# EAGLE design Test PCB (EAGLE 6.5.0)
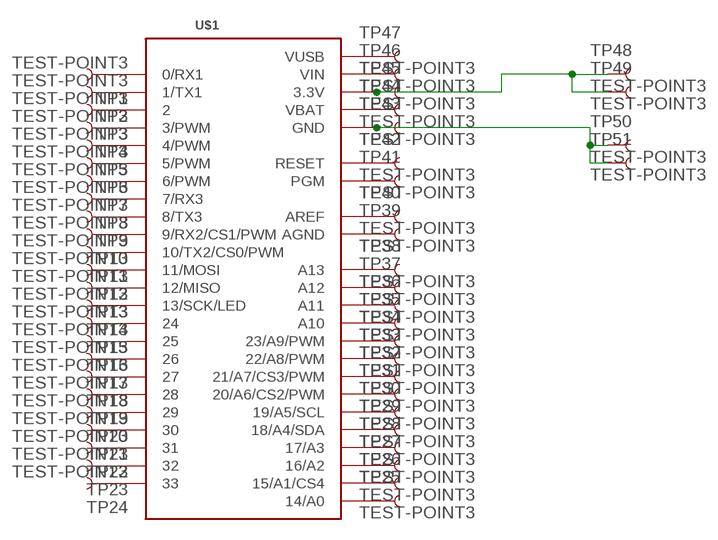
[diagram p0: schematic, sheet 1]

## Parts
TP1  TEST-POINT3  [PAD.03X.03]
TP2  TEST-POINT3  [PAD.03X.03]
TP3  TEST-POINT3  [PAD.03X.03]
TP4  TEST-POINT3  [PAD.03X.03]
TP5  TEST-POINT3  [PAD.03X.03]
TP6  TEST-POINT3  [PAD.03X.03]
TP7  TEST-POINT3  [PAD.03X.03]
TP8  TEST-POINT3  [PAD.03X.03]
TP9  TEST-POINT3  [PAD.03X.03]
TP10  TEST-POINT3  [PAD.03X.03]
TP11  TEST-POINT3  [PAD.03X.03]
TP12  TEST-POINT3  [PAD.03X.03]
TP13  TEST-POINT3  [PAD.03X.03]
TP14  TEST-POINT3  [PAD.03X.03]
TP15  TEST-POINT3  [PAD.03X.03]
TP16  TEST-POINT3  [PAD.03X.03]
TP17  TEST-POINT3  [PAD.03X.03]
TP18  TEST-POINT3  [PAD.03X.03]
TP19  TEST-POINT3  [PAD.03X.03]
TP20  TEST-POINT3  [PAD.03X.03]
TP21  TEST-POINT3  [PAD.03X.03]
TP22  TEST-POINT3  [PAD.03X.03]
TP23  TEST-POINT3  [PAD.03X.03]
TP24  TEST-POINT3  [PAD.03X.03]
TP25  TEST-POINT3  [PAD.03X.03]
TP26  TEST-POINT3  [PAD.03X.03]
TP27  TEST-POINT3  [PAD.03X.03]
TP28  TEST-POINT3  [PAD.03X.03]
TP29  TEST-POINT3  [PAD.03X.03]
TP30  TEST-POINT3  [PAD.03X.03]
TP31  TEST-POINT3  [PAD.03X.03]
TP32  TEST-POINT3  [PAD.03X.03]
TP33  TEST-POINT3  [PAD.03X.03]
TP34  TEST-POINT3  [PAD.03X.03]
TP35  TEST-POINT3  [PAD.03X.03]
TP36  TEST-POINT3  [PAD.03X.03]
TP37  TEST-POINT3  [PAD.03X.03]
TP38  TEST-POINT3  [PAD.03X.03]
TP39  TEST-POINT3  [PAD.03X.03]
TP40  TEST-POINT3  [PAD.03X.03]
TP41  TEST-POINT3  [PAD.03X.03]
TP42  TEST-POINT3  [PAD.03X.03]
TP43  TEST-POINT3  [PAD.03X.03]
TP44  TEST-POINT3  [PAD.03X.03]
TP45  TEST-POINT3  [PAD.03X.03]
TP46  TEST-POINT3  [PAD.03X.03]
TP47  TEST-POINT3  [PAD.03X.03]
TP48  TEST-POINT3  [PAD.03X.03]
TP49  TEST-POINT3  [PAD.03X.03]
TP50  TEST-POINT3  [PAD.03X.03]
TP51  TEST-POINT3  [PAD.03X.03]
U$1  TEENSY_3.0_ALLPINSTEENSY_3.0_ALLPINS-SMD  [TEENSY_3.0_ALLPINS-SMD]

## Nets
N$1: TP1.P$1 U$1.0(0/RX1)
N$2: TP2.P$1 U$1.1(1/TX1)
N$3: TP3.P$1 U$1.2
N$4: TP4.P$1 U$1.3(3/PWM)
N$5: TP5.P$1 U$1.4(4/PWM)
N$6: TP6.P$1 U$1.5(5/PWM)
N$7: TP7.P$1 U$1.6(6/PWM)
N$8: TP8.P$1 U$1.7(7/RX3)
N$9: TP9.P$1 U$1.8(8/TX3)
N$10: TP10.P$1 U$1.9(9/RX2/CS1/PWM)
N$11: TP11.P$1 U$1.10(10/TX2/CS0/PWM)
N$12: TP12.P$1 U$1.11(11/MOSI)
N$13: TP13.P$1 U$1.12(12/MISO)
N$14: TP14.P$1 U$1.13(13/SCK/LED)
N$15: TP15.P$1 U$1.24
N$16: TP16.P$1 U$1.25
N$17: TP17.P$1 U$1.26
N$18: TP18.P$1 U$1.27
N$19: TP19.P$1 U$1.28
N$20: TP20.P$1 U$1.29
N$21: TP21.P$1 U$1.30
N$22: TP22.P$1 U$1.31
N$23: TP23.P$1 U$1.32
N$24: TP24.P$1 U$1.33
N$25: TP25.P$1 U$1.14/A0
N$26: TP26.P$1 U$1.15/A1(15/A1/CS4)
N$27: TP27.P$1 U$1.16/A2
N$28: TP28.P$1 U$1.17/A3
N$29: TP29.P$1 U$1.18/A4(18/A4/SDA)
N$30: TP30.P$1 U$1.19/A5(19/A5/SCL)
N$31: TP31.P$1 U$1.20/A6(20/A6/CS2/PWM)
N$32: TP32.P$1 U$1.21/A7(21/A7/CS3/PWM)
N$33: TP33.P$1 U$1.22/A8(22/A8/PWM)
N$34: TP34.P$1 U$1.23/A9(23/A9/PWM)
N$35: TP35.P$1 U$1.A10
N$36: TP36.P$1 U$1.A11
N$37: TP37.P$1 U$1.A12
N$38: TP38.P$1 U$1.A13
N$39: TP39.P$1 U$1.AGND
N$40: TP40.P$1 U$1.AREF
N$41: TP41.P$1 U$1.PGM
N$42: TP42.P$1 U$1.RESET
N$44: TP44.P$1 U$1.VBAT
N$45: TP43.P$1 TP50.P$1 TP51.P$1 U$1.GND U$1.GND1(GND) U$1.GND2(GND)
N$46: TP46.P$1 U$1.VIN
N$47: TP47.P$1 U$1.VUSB
N$48: TP45.P$1 TP48.P$1 TP49.P$1 U$1.3.3V U$1.3.3V1(3.3V) U$1.3.3V2(3.3V)

## Library data of the parts
TP1-TP51 = SparkFun-Passives:TEST-POINT: Bare copper test points for troubleshooting or ICT
U$1 = Teensy3.0:TEENSY_3.0_ALLPINS: Teensy 3.0 with all pin holes and optional SMD-mount unshrouded header on bottom of Teensy 3.0. For more basic versions, see 'Basic', '+4' and 'AllAnalogPins'. Requires the installation of a un-shrouded SMD header on the underside of the Teensy 3.0

## Board
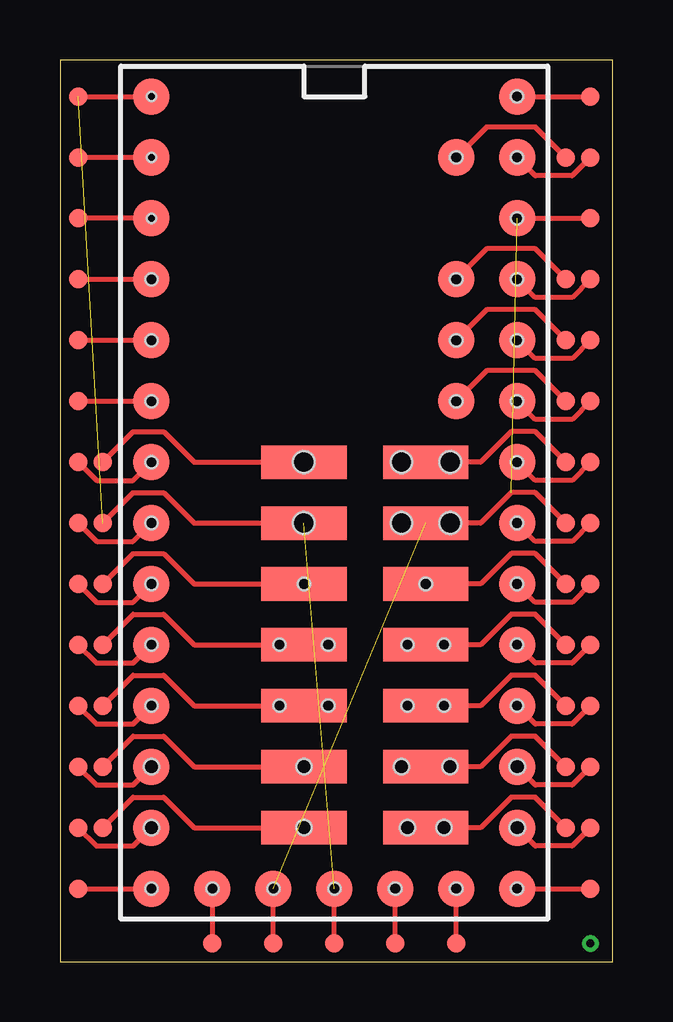
[diagram p1: board, top side]

Size 23.04 x 37.58 mm. Coordinates in mm from the lower left corner, seen from the top.
Outline: 0,0 23.04,0 23.04,37.58 0,37.58 0,0
Copper layers (1*16): Top 0.0356mm / dielectric 1.5011mm / Bottom 0.0356mm
Design rules "LaenPCBOrder": minimum track width 6mil, minimum drill 13mil, track to track 6mil, track to pad 6mil, pad to pad 6mil, via to via 6mil, smd to smd 6mil, copper to edge 15mil, drill to drill 6mil, minimum pad ring 7mil, minimum via ring 7mil, stop-mask expansion 4mil, vias tented up to drill 0mil, thermal gap 10mil
Holes 0.64 mm at 14.48,5.59 16,5.59 14.22,8.13 16.26,8.13 3.81,8.13 3.81,5.59 19.05,5.59 19.05,8.13 10.16,8.13 10.16,5.59
Holes 0.51 mm at 14.48,10.67 16,10.67 14.48,13.21 16,13.21 9.14,13.21 11.18,13.21 3.81,28.45 3.81,25.91 3.81,23.37 3.81,20.83 3.81,18.29 3.81,15.75 3.81,13.21 3.81,10.67 3.81,3.05 6.35,3.05 8.89,3.05 11.43,3.05 13.97,3.05 16.51,3.05 19.05,3.05 19.05,10.67 19.05,13.21 19.05,15.75 19.05,18.29 19.05,20.83 19.05,23.37 19.05,25.91 19.05,28.45 19.05,30.99 19.05,33.53 19.05,36.07 16.51,33.53 16.51,28.45 16.51,25.91 16.51,23.37 10.16,15.75 15.24,15.75 9.14,10.67 11.18,10.67
Holes 0.89 mm at 14.22,18.29 16.26,18.29 14.22,20.83 16.26,20.83 10.16,20.83 10.16,18.29
Holes 0.38 mm at 3.81,36.07 3.81,33.53 3.81,30.99

### Footprints (pad centres in the part's own frame; a part is rotated, then mirrored left to right if it is on the bottom)
PAD.03X.03 = smd 0.762 x 0.762: P$1 0,0
TEENSY_3.0_ALLPINS-SMD = smd 1.524 x 1.524: 0 -7.62,15.24; 1 -7.62,12.7; 2 -7.62,10.16; 3 -7.62,7.62; 3.3V 7.62,12.7; 3.3V1 -2.54,-15.24; 4 -7.62,5.08; 5 -7.62,2.54; 6 -7.62,0; 7 -7.62,-2.54; 8 -7.62,-5.08; 9 -7.62,-7.62; 10 -7.62,-10.16; 11 -7.62,-12.7; 12 -7.62,-15.24; 13 7.62,-15.24; 14/A0 7.62,-12.7; 15/A1 7.62,-10.16; 16/A2 7.62,-7.62; 17/A3 7.62,-5.08; 18/A4 7.62,-2.54; 19/A5 7.62,0; 20/A6 7.62,2.54; 21/A7 7.62,5.08; 22/A8 7.62,7.62; 23/A9 7.62,10.16; A10 5.08,7.62; A11 5.08,5.08; AGND 7.62,15.24; AREF 5.08,10.16; GND -7.62,17.78; GND1 0,-15.24; PGM 2.54,-15.24; RESET 5.08,-15.24; VBAT -5.08,-15.24; VIN 7.62,17.78; VUSB 5.08,15.24 | smd 3.556 x 1.397: 3.3V2 3.81,0; 24 -1.27,-2.54; 25 -1.27,-5.08; 26 -1.27,-7.62; 27 -1.27,-10.16; 28 -1.27,-12.7; 29 3.81,-12.7; 30 3.81,-10.16; 31 3.81,-7.62; 32 3.81,-5.08; 33 3.81,-2.54; A12 -1.27,2.54; A13 3.81,2.54; GND2 -1.27,0

### Placement (x,y rotation side)
TP1  0.76,33.53 0 top
TP2  0.76,30.99 0 top
TP3  0.76,28.45 0 top
TP4  0.76,25.91 0 top
TP5  0.76,23.37 0 top
TP6  0.76,20.83 0 top
TP7  0.76,18.29 0 top
TP8  0.76,15.75 0 top
TP9  0.76,13.21 0 top
TP10  0.76,10.67 0 top
TP11  0.76,8.13 0 top
TP12  0.76,5.59 0 top
TP13  0.76,3.05 0 top
TP14  22.1,3.05 0 top
TP15  1.78,15.75 0 top
TP16  1.78,13.21 0 top
TP17  1.78,10.67 0 top
TP18  1.78,8.13 0 top
TP19  1.78,5.59 0 top
TP20  21.08,5.59 0 top
TP21  21.08,8.13 0 top
TP22  21.08,10.67 0 top
TP23  21.08,13.21 0 top
TP24  21.08,15.75 0 top
TP25  22.1,5.59 0 top
TP26  22.1,8.13 0 top
TP27  22.1,10.67 0 top
TP28  22.1,13.21 0 top
TP29  22.1,15.75 0 top
TP30  22.1,18.29 0 top
TP31  22.1,20.83 0 top
TP32  22.1,23.37 0 top
TP33  22.1,25.91 0 top
TP34  22.1,28.45 0 top
TP35  21.08,25.91 0 top
TP36  21.08,23.37 0 top
TP37  1.78,20.83 0 top
TP38  21.08,20.83 0 top
TP39  22.1,33.53 0 top
TP40  21.08,28.45 0 top
TP41  13.97,0.76 0 top
TP42  16.51,0.76 0 top
TP43  11.43,0.76 0 top
TP44  6.35,0.76 0 top
TP45  8.89,0.76 0 top
TP46  22.1,36.07 0 top
TP47  21.08,33.53 0 top
TP48  21.08,18.29 0 top
TP49  22.1,30.99 0 top
TP50  0.76,36.07 0 top
TP51  1.78,18.29 0 top
U$1  11.43,18.29 0 top

### Tracks (layer width: path | path; a pad name or v marks a point on that pad's centre or on a via)
N$1
  Top 0.203: U$1.0 TP1.P$1
N$2
  Top 0.203: U$1.1 TP2.P$1
N$3
  Top 0.203: TP3.P$1 U$1.2
N$4
  Top 0.203: TP4.P$1 U$1.3
N$5
  Top 0.203: TP5.P$1 U$1.4
N$6
  Top 0.203: TP6.P$1 1.52,20.07 3.05,20.07 U$1.5
N$7
  Top 0.203: TP7.P$1 1.52,17.53 3.05,17.53 U$1.6
N$8
  Top 0.203: TP8.P$1 1.52,14.99 3.05,14.99 U$1.7
N$9
  Top 0.203: TP9.P$1 1.52,12.45 3.05,12.45 U$1.8
N$10
  Top 0.203: TP10.P$1 1.52,9.91 3.05,9.91 U$1.9
N$11
  Top 0.203: TP11.P$1 1.52,7.37 3.05,7.37 U$1.10
N$12
  Top 0.203: TP12.P$1 1.52,4.83 3.05,4.83 U$1.11
N$13
  Top 0.203: TP13.P$1 U$1.12
N$14
  Top 0.203: U$1.13 TP14.P$1
N$15
  Top 0.203: TP15.P$1 3.05,17.02 4.32,17.02 5.59,15.75 U$1.24
N$16
  Top 0.203: TP16.P$1 3.05,14.48 4.32,14.48 5.59,13.21 U$1.25
N$17
  Top 0.203: TP17.P$1 3.05,11.94 4.32,11.94 5.59,10.67 U$1.26
N$18
  Top 0.203: TP18.P$1 3.05,9.4 4.32,9.4 5.59,8.13 U$1.27
N$19
  Top 0.203: TP19.P$1 3.05,6.86 4.32,6.86 5.59,5.59 U$1.28
N$20
  Top 0.203: TP20.P$1 19.81,6.86 18.8,6.86 17.53,5.59 U$1.29
N$21
  Top 0.203: TP21.P$1 19.81,9.4 18.8,9.4 17.53,8.13 U$1.30
N$22
  Top 0.203: TP22.P$1 19.81,11.94 18.8,11.94 17.53,10.67 U$1.31
N$23
  Top 0.203: TP23.P$1 19.81,14.48 18.8,14.48 17.53,13.21 U$1.32
N$24
  Top 0.203: TP24.P$1 19.81,17.02 18.8,17.02 17.53,15.75 U$1.33
N$25
  Top 0.203: TP25.P$1 21.34,4.83 19.81,4.83 U$1.14/A0
N$26
  Top 0.203: TP26.P$1 21.34,7.37 19.81,7.37 U$1.15/A1
N$27
  Top 0.203: TP27.P$1 21.34,9.91 19.81,9.91 U$1.16/A2
N$28
  Top 0.203: TP28.P$1 21.34,12.45 19.81,12.45 U$1.17/A3
N$29
  Top 0.203: TP29.P$1 21.34,14.99 19.81,14.99 U$1.18/A4
N$30
  Top 0.203: TP30.P$1 21.34,17.53 19.81,17.53 U$1.19/A5
N$31
  Top 0.203: TP31.P$1 21.34,20.07 19.81,20.07 U$1.20/A6
N$32
  Top 0.203: TP32.P$1 21.34,22.61 19.81,22.61 U$1.21/A7
N$33
  Top 0.203: TP33.P$1 21.34,25.15 19.81,25.15 U$1.22/A8
N$34
  Top 0.203: TP34.P$1 21.34,27.69 19.81,27.69 U$1.23/A9
N$35
  Top 0.203: TP35.P$1 19.81,27.18 17.78,27.18 U$1.A10
N$36
  Top 0.203: TP36.P$1 19.81,24.64 17.78,24.64 U$1.A11
N$37
  Top 0.203: TP37.P$1 3.05,22.1 4.32,22.1 5.59,20.83 U$1.A12
N$38
  Top 0.203: TP38.P$1 19.81,22.1 18.8,22.1 17.53,20.83 U$1.A13
N$39
  Top 0.203: TP39.P$1 21.34,32.77 19.81,32.77 U$1.AGND
N$40
  Top 0.203: TP40.P$1 19.81,29.72 17.78,29.72 U$1.AREF
N$41
  Top 0.203: TP41.P$1 U$1.PGM
N$42
  Top 0.203: TP42.P$1 U$1.RESET
N$43  (via drill 0.33)
  other vias: 22.1,0.76
N$44
  Top 0.203: U$1.VBAT TP44.P$1
N$45  (2 unrouted)
  Top 0.203: TP43.P$1 U$1.GND1 | TP51.P$1 3.05,19.56 4.32,19.56 5.59,18.29 U$1.GND2 | TP50.P$1 U$1.GND
N$46
  Top 0.203: U$1.VIN TP46.P$1
N$47
  Top 0.203: TP47.P$1 19.81,34.8 17.78,34.8 U$1.VUSB
N$48  (2 unrouted)
  Top 0.203: TP45.P$1 U$1.3.3V1 | TP48.P$1 19.81,19.56 18.8,19.56 17.53,18.29 U$1.3.3V2 | U$1.3.3V TP49.P$1

### Text on the board
bNames: 0.015 | All unlabeled | GND | holes = 0.02" | Vin | 0 | AGND:VUSB | 1 | 3.3v | 2 | 23:AREF | 3 | 22:A10 | 4 | 21:A11 | 5:A12 | .035 | 20:A13 | 6:GND | 19:3.3v | 7:24 | .020 | 18:33 | 8:25 | 17:32 | 9:26 | 16:31 | 10:27 | .025 | 15:30 | 11:28 | 14:29 | 12 | 13 | vbat | 3.3v | GND | PRG | RST